# Altium project PendulOptic.PrjPcb
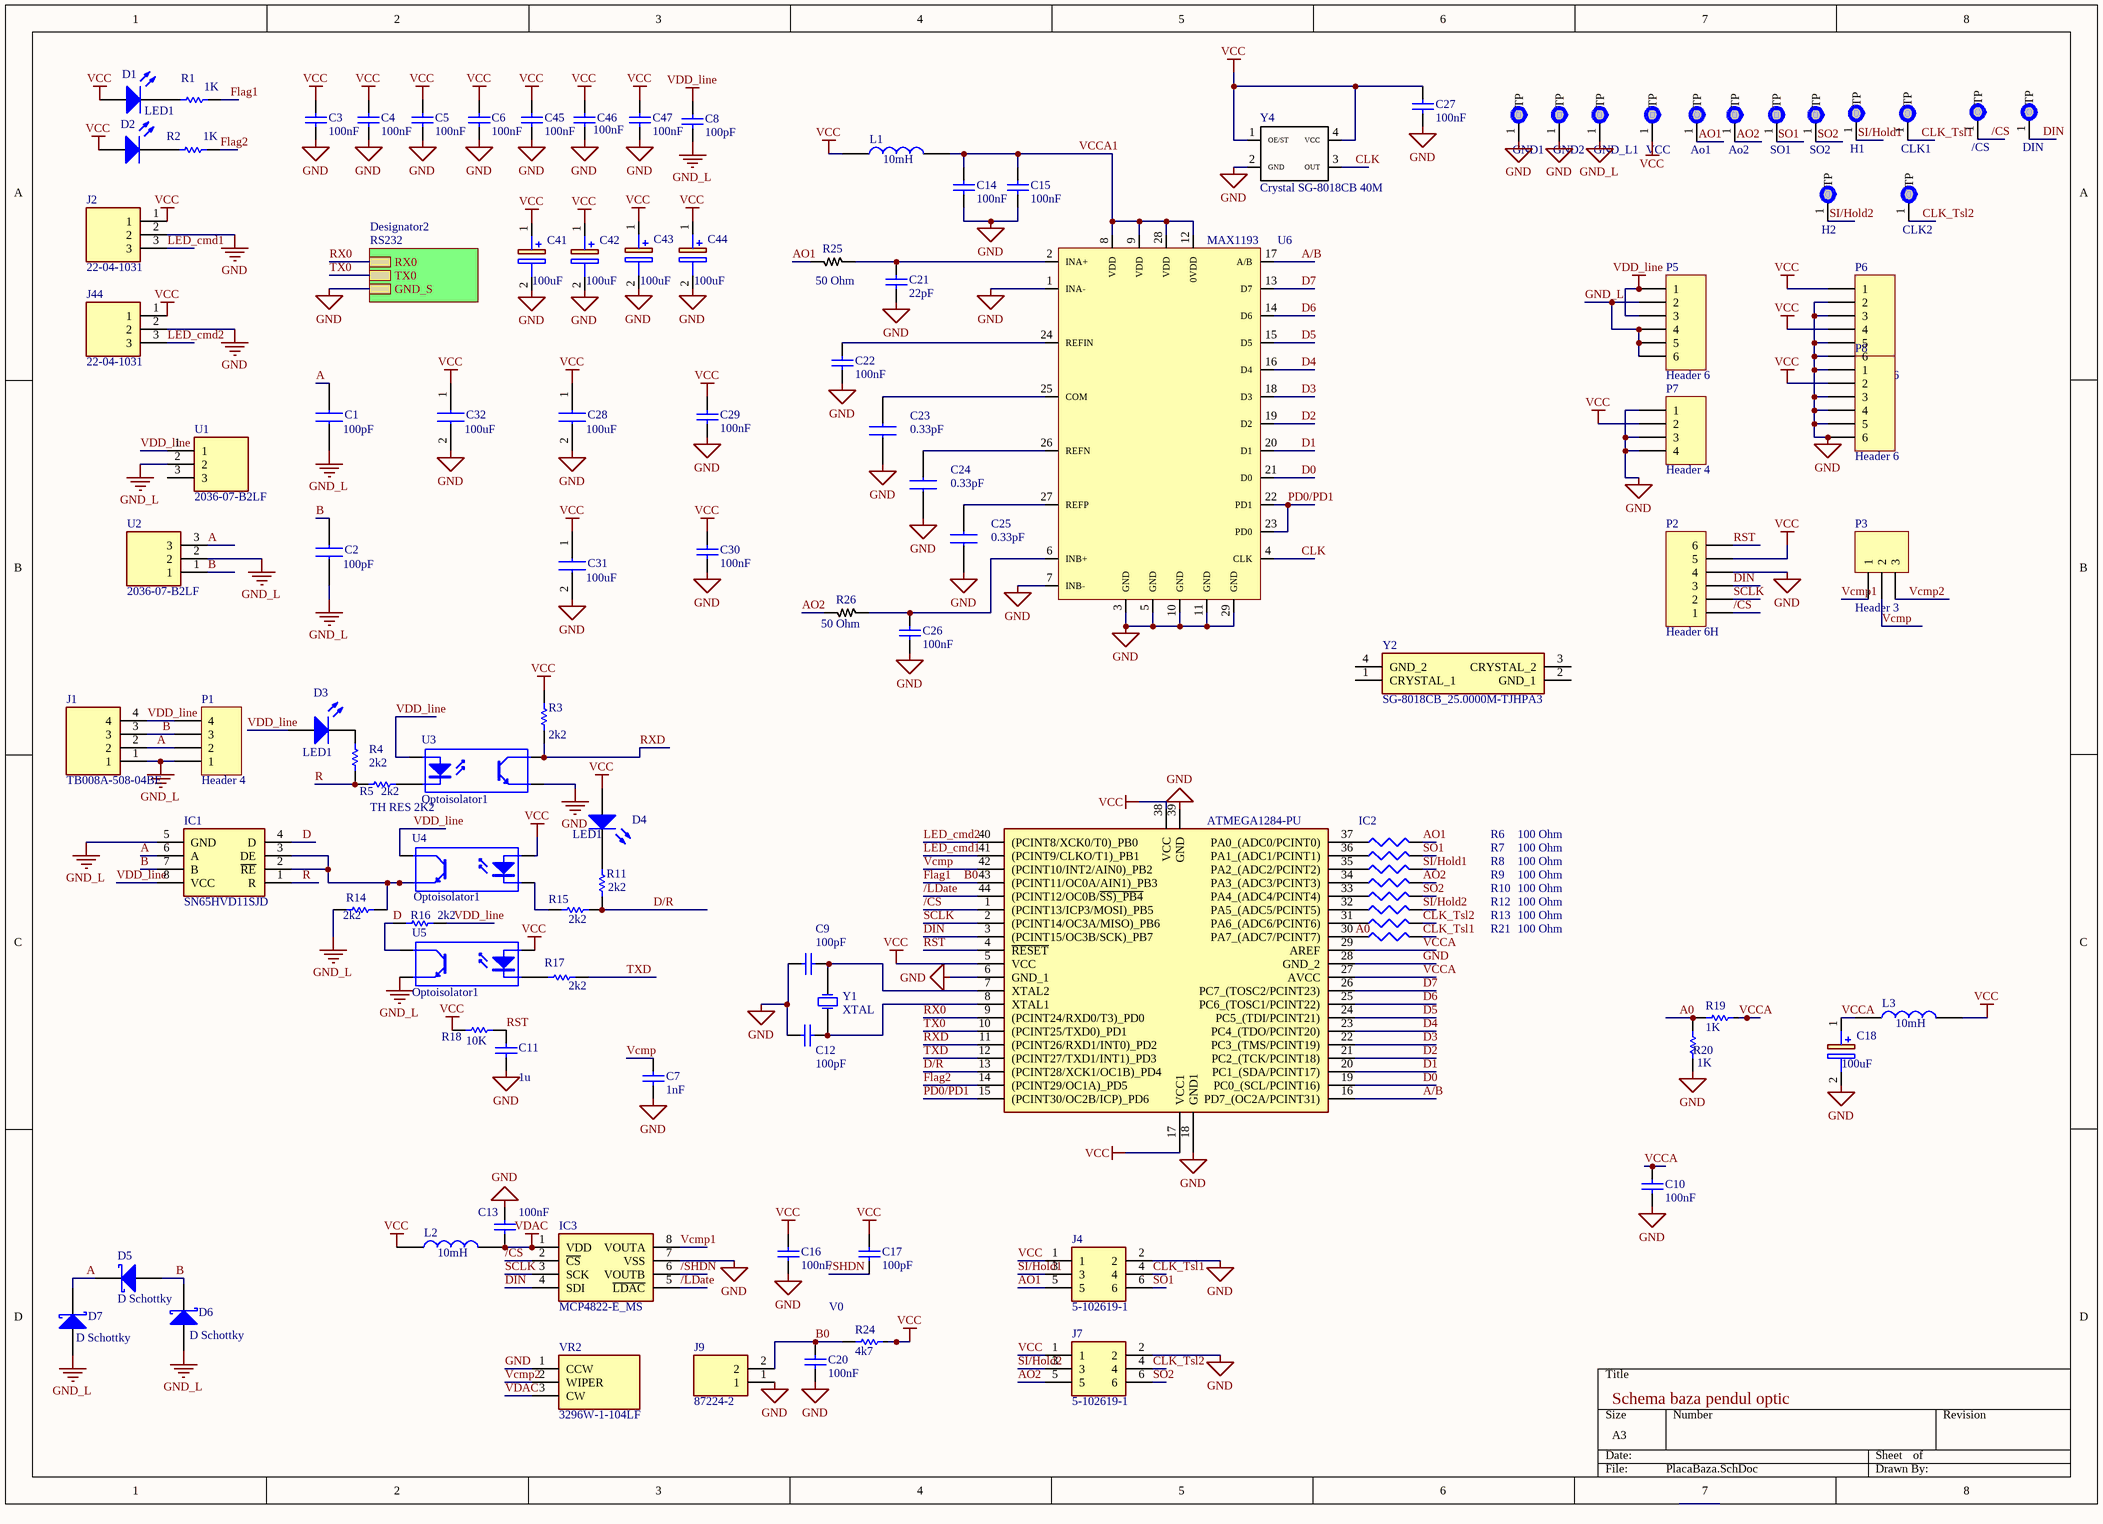
[diagram p0: PlacaBaza.SchDoc]
2 sheets, 133 parts. Net scope: hierarchical (ports join the sheet entries above them; power ports are global).
Board file: PendulOptic_pcb 1.PcbDoc
Sheets:
  PlacaBaza.SchDoc
    Designator2 = RS232.SchDoc

## Sheet PlacaBaza.SchDoc
size A3

### Parts
/CS  Testpoint  [TP]  (value not drawn)
Ao1  Testpoint  [TP]  (value not drawn)
Ao2  Testpoint  [TP]  (value not drawn)
C1  value 100pF  [1206 CAP]  (hidden comment: 1206CAP 100pF)
C2  value 100pF  [1206 CAP]  (hidden comment: 1206CAP 100pF)
C3  value 100nF  [1206 CAP]  (hidden comment: 1206CAP 100nF)
C4  value 100nF  [1206 CAP]  (hidden comment: 1206CAP 100nF)
C5  value 100nF  [1206 CAP]  (hidden comment: 1206CAP 100nF)
C6  value 100nF  [1206 CAP]  (hidden comment: 1206CAP 100nF)
C7  value 1nF  [1206 CAP]  (hidden comment: 1206CAP 1nF)
C8  value 100pF  [1206 CAP]  (hidden comment: 1206CAP 100nF)
C9  value 100pF  [1206 CAP]  (hidden comment: 1206CAP 100pF)
C10  value 100nF  [1206 CAP]  (hidden comment: 1206CAP 100nF)
C11  value 1u  [1206 CAP]  (hidden comment: 1206CAP 1uF)
C12  value 100pF  [1206 CAP]  (hidden comment: 1206CAP 100pF)
C13  value 100nF  [1206 CAP]  (hidden comment: 1206CAP 100nF)
C14  value 100nF  [1206 CAP]  (hidden comment: 1206CAP 100nF)
C15  value 100nF  [1206 CAP]  (hidden comment: 1206CAP 100nF)
C16  value 100nF  [1206 CAP]  (hidden comment: 1206CAP 100nF)
C17  value 100pF  [1206 CAP]  (hidden comment: 1206CAP 100pF)
C18  value 100uF  [CAPPRD275W50D630H1100]  (hidden comment: polarized cap 2.75 pitch)
C20  value 100nF  [1206 CAP]  (hidden comment: 1206CAP 100nF)
C21  value 22pF  [1206 CAP]  (hidden comment: 1206CAP 22pF)
C22  value 100nF  [1206 CAP]  (hidden comment: 1206CAP 100nF)
C23  value 0.33pF  [0805]  (hidden comment: 1206CAP 0.33uF)
C24  value 0.33pF  [0805]  (hidden comment: 1206CAP 0.33uF)
C25  value 0.33pF  [0805]  (hidden comment: 1206CAP 0.33uF)
C26  value 100nF  [1206 CAP]  (hidden comment: 1206CAP 100nF)
C27  value 100nF  [1206 CAP]  (hidden comment: 1206CAP 100nF)
C28  value 100uF  [CAPPRD275W50D630H1100]  (hidden comment: polarized cap 2.75mm pitch)
C29  value 100nF  [1206 CAP]  (hidden comment: 1206CAP 100nF)
C30  value 100nF  [1206 CAP]  (hidden comment: 1206CAP 100nF)
C31  value 100uF  [CAPPRD275W50D630H1100]  (hidden comment: polarized cap 2.75mm pitch)
C32  value 100uF  [CAPPRD275W50D630H1100]  (hidden comment: polarized cap 2.75mm pitch)
C41  value 100uF  [CAPPRD275W50D630H1100]  (hidden comment: polarized cap 2.75mm pitch)
C42  value 100uF  [CAPPRD275W50D630H1100]  (hidden comment: polarized cap 2.75mm pitch)
C43  value 100uF  [CAPPRD275W50D630H1100]  (hidden comment: polarized cap 2.75mm pitch)
C44  value 100uF  [CAPPRD275W50D630H1100]  (hidden comment: polarized cap 2.75mm pitch)
C45  value 100nF  [1206 CAP]  (hidden comment: 1206CAP 100nF)
C46  value 100nF  [1206 CAP]  (hidden comment: 1206CAP 100nF)
C47  value 100nF  [1206 CAP]  (hidden comment: 1206CAP 100nF)
CLK1  Testpoint  [TP]  (value not drawn)
CLK2  Testpoint  [TP]  (value not drawn)
D1  LED1  [LED-1]
D2  LED1  [LED-1]  (value not drawn)
D3  LED1  [C1206]
D4  LED1  [C1206]
D5  D Schottky  [SMB]
D6  D Schottky  [SMB]
D7  D Schottky  [SMB]
DIN  Testpoint  [TP]  (value not drawn)
GND1  Testpoint  [TP]  (value not drawn)
GND2  Testpoint  [TP]  (value not drawn)
GND_L1  Testpoint  [TP]  (value not drawn)
H1  Testpoint  [TP]  (value not drawn)
H2  Testpoint  [TP]  (value not drawn)
IC1  SN65HVD11SJD  [DIP-8]
IC2  ATMEGA1284-PU  [QFP80P1200X1200X120-44N]
IC3  MCP4822-E_MS  [SOP65P490X110-8N]
J1  TB008A-508-04BE  [HDR1X4]
J2  22-04-1031  [SHDR3W64P0X250_1X3_700X580X1170P]
J4  5-102619-1  [SHDR6W66P254_2X3_1473X1016X1118P]
J7  5-102619-1  [SHDR6W66P254_2X3_1473X1016X1118P]
J9  87224-2  [872242]
J44  22-04-1031  [SHDR3W64P0X250_1X3_700X580X1170P]
L1  value 10mH  [RLB0608471KL]  (hidden comment: RLB0608-471KL)
L2  value 10mH  [RLB0608471KL]  (hidden comment: RLB0608-471KL)
L3  value 10mH  [RLB0608471KL]  (hidden comment: RLB0608-471KL)
P1  Header 4  [HDR1X4]
P2  Header 6H  [HDR1X6]
P3  Header 3  [HDR1X3]
P5  Header 6  [HDR1X6]
P6  Header 6  [HDR1X6]
P7  Header 4  [HDR1X4]
P8  Header 6  [HDR1X6]
R1  value 1K  [AXIAL-0.3]  (hidden comment: TH RES 1K)
R2  value 1K  [AXIAL-0.3]  (hidden comment: TH RES 1K)
R3  value 2k2  [AXIAL-0.3]  (hidden comment: TH RES 2K2)
R4  value 2k2  [AXIAL-0.3]  (hidden comment: TH RES 2K2)
R5  TH RES 2K2  value 2k2  [AXIAL-0.3]
R6  value 100 Ohm  [0805]  (hidden comment: 0805RES 100 OHM)
R7  value 100 Ohm  [0805]  (hidden comment: 0805RES 100 OHM)
R8  value 100 Ohm  [0805]  (hidden comment: 0805RES 100 OHM)
R9  value 100 Ohm  [0805]  (hidden comment: 0805RES 100 OHM)
R10  value 100 Ohm  [0805]  (hidden comment: 0805RES 100 OHM)
R11  value 2k2  [AXIAL-0.3]  (hidden comment: TH RES 2K2)
R12  value 100 Ohm  [0805]  (hidden comment: 0805RES 100 OHM)
R13  value 100 Ohm  [0805]  (hidden comment: 0805RES 100 OHM)
R14  value 2k2  [AXIAL-0.3]  (hidden comment: TH RES 2K2)
R15  value 2k2  [AXIAL-0.3]  (hidden comment: TH RES 2K2)
R16  value 2k2  [AXIAL-0.3]  (hidden comment: TH RES 2K2)
R17  value 2k2  [AXIAL-0.3]  (hidden comment: TH RES 2K2)
R18  value 10K  [C1206]  (hidden comment: TH RES 2K2)
R19  value 1K  [1206 CAP]  (hidden comment: 1206RES 1K)
R20  value 1K  [1206 CAP]  (hidden comment: 1206RES 1K)
R21  value 100 Ohm  [0805]  (hidden comment: 0805RES 100 OHM)
R24  value 4k7  [1206 CAP]  (hidden comment: 1206RES 4K7)
R25  value 50 Ohm  [0805]  (hidden comment: 0805RES 50 OHM)
R26  value 50 Ohm  [0805]  (hidden comment: 0805RES 50 OHM)
SO1  Testpoint  [TP]  (value not drawn)
SO2  Testpoint  [TP]  (value not drawn)
U1  2036-07-B2LF  [203607B2LF]
U2  2036-07-B2LF  [203607B2LF]
U3  Optoisolator1  [DIP-4]
U4  Optoisolator1  [DIP-4]
U5  Optoisolator1  [DIP-4]
U6  MAX1193  [QFN50P500X500X80_HS-29N]
VCC  Testpoint  [TP]  (value not drawn)
VR2  3296W-1-104LF  [3296W-1]
Y1  XTAL  [RAD-0.2]
Y2  SG-8018CB_25.0000M-TJHPA3  [SG8018CB250000MTJHPA3]
Y4  Crystal SG-8018CB 40M  [SG-8018CB]

### Sub-sheets
Designator2 = RS232: RX0, TX0, GND_S

### Nets
GND: C3.1 C4.1 C5.1 C6.1 C7.1 C9.1 C10.1 C11.1 C12.1 C13.1 C14.1 C15.1 C16.1 C18.2(-) C20.1 C21.1 C22.1 C23.1 C24.1 C25.1 C26.1 C27.1 C28.2(-) C29.1 C30.1 C31.2(-) C32.2(-) C41.2(-) C42.2(-) C43.2(-) C44.2(-) C45.1 C46.1 C47.1 GND1.1(TP) GND2.1(TP) IC2.6(GND_1) IC2.18(GND1) IC2.28(GND_2) IC2.39(GND) IC3.7(VSS) J2.2 J4.2 J7.2 J9.1 J44.2 P2.4 P6.2 P6.3 P6.5 P6.6 P7.1 P7.3 P7.4 P8.1 P8.3 P8.4 P8.5 P8.6 R20.1 U3.3(E) U6.1(INA-) U6.3(GND) U6.5(GND) U6.7(INB-) U6.10(GND) U6.11(GND) U6.29(GND) VR2.1(CCW) Y4.2(GND) ; sheet Designator2/GND_S
GND_L: C1.1 C2.1 C8.1 D6.1(A) D7.1(A) GND_L1.1(TP) IC1.5(GND) J1.1 P1.1 P5.2 P5.4 P5.5 P5.6 R14.1 U1.2 U2.2 U5.3(E)
VCC: C3.2 C4.2 C5.2 C6.2 C16.2 C17.2 C27.2 C28.1(+) C29.2 C30.2 C31.1(+) C32.1(+) C41.1(+) C42.1(+) C43.1(+) C44.1(+) C45.2 C46.2 C47.2 D1.1(A) D2.1(A) D4.1(A) IC2.5(VCC) IC2.17(VCC1) IC2.38(VCC) J2.1 J4.1 J7.1 J44.1 L1.1 L2.1 L3.2 P2.5 P6.1 P6.4 P7.2 P8.2 R3.2 R18.1 R24.2 U4.1(A) U5.1(A) VCC.1(TP) Y4.1(OE/ST) Y4.4(VCC)
VDAC: C13.2 IC3.1(VDD) L2.2 VR2.3(CW)
VDD_line: C8.2 D3.1(A) IC1.8(VCC) J1.4 P1.4 P5.1 P5.3 R16.2 U1.1 U3.1(A) U4.4(C)
/CS: /CS.1(TP) IC2.1((PCINT13/ICP3/MOSI)_PB5) IC3.2(~{CS}) P2.1
/LDate: IC2.44((PCINT12/OC0B/~{SS)_PB4}) IC3.5(~{LDAC})
/SHDN: C17.1 IC3.6(VOUTB)
A: C1.2 D5.2(K) D7.2(K) IC1.6(A) J1.2 P1.2 U2.3
A0: IC2.30(PA7_(ADC7/PCINT7)) R19.1 R20.2 R21.1
A/B: IC2.16(PD7_(OC2A/PCINT31)) U6.17(A/B)
AO1: Ao1.1(TP) J4.5 R6.2 R25.2
AO2: Ao2.1(TP) J7.5 R9.2 R26.2
B: C2.2 D5.1(A) D6.2(K) IC1.7(B) J1.3 P1.3 U2.1
B0: C20.2 IC2.43((PCINT11/OC0A/AIN1)_PB3) J9.2 R1.1 R24.1  [also labelled Flag1]
CLK: U6.4(CLK) Y4.3(OUT)
CLK_Tsl1: CLK1.1(TP) J4.4 R21.2
CLK_Tsl2: CLK2.1(TP) J7.4 R13.2
D: IC1.4(D) R16.1 U5.4(C)
D0: IC2.19(PC0_(SCL/PCINT16)) U6.21(D0)
D1: IC2.20(PC1_(SDA/PCINT17)) U6.20(D1)
D2: IC2.21(PC2_(TCK/PCINT18)) U6.19(D2)
D3: IC2.22(PC3_(TMS/PCINT19)) U6.18(D3)
D4: IC2.23(PC4_(TDO/PCINT20)) U6.16(D4)
D5: IC2.24(PC5_(TDI/PCINT21)) U6.15(D5)
D6: IC2.25(PC6_(TOSC1/PCINT22)) U6.14(D6)
D7: IC2.26(PC7_(TOSC2/PCINT23)) U6.13(D7)
D/R: IC2.13((PCINT28/XCK1/OC1B)_PD4) R11.1 R15.2
DIN: DIN.1(TP) IC2.3((PCINT15/OC3B/SCK)_PB7) IC3.4(SDI) P2.3
Flag2: IC2.14((PCINT29/OC1A)_PD5) R2.1
LED_cmd1: IC2.41((PCINT9/CLKO/T1)_PB1) J2.3
LED_cmd2: IC2.40((PCINT8/XCK0/T0)_PB0) J44.3
PD0/PD1: IC2.15((PCINT30/OC2B/ICP)_PD6) U6.22(PD1) U6.23(PD0)
R: IC1.1(R) R4.1 R5.1
RST: C11.2 IC2.4(~{RESET}) P2.6 R18.2
RX0: IC2.9((PCINT24/RXD0/T3)_PD0) ; sheet Designator2/RX0
RXD: IC2.11((PCINT26/RXD1/INT0)_PD2) R3.1 U3.4(C)
SCLK: IC2.2((PCINT14/OC3A/MISO)_PB6) IC3.3(SCK) P2.2
SI/Hold1: H1.1(TP) J4.3 R8.2
SI/Hold2: H2.1(TP) J7.3 R12.2
SO1: J4.6 R7.2 SO1.1(TP)
SO2: J7.6 R10.2 SO2.1(TP)
TX0: IC2.10((PCINT25/TXD0)_PD1) ; sheet Designator2/TX0
TXD: IC2.12((PCINT27/TXD1/INT1)_PD3) R17.2
VCCA: C10.2 C18.1(+) IC2.27(AVCC) IC2.29(AREF) L3.1 R19.2
VCCA1: C14.2 C15.2 L1.2 U6.8(VDD) U6.9(VDD) U6.12(0VDD) U6.28(VDD)
Vcmp: C7.2 IC2.42((PCINT10/INT2/AIN0)_PB2) P3.2
Vcmp1: IC3.8(VOUTA) P3.1
Vcmp2: P3.3 VR2.2(WIPER)
NetC9_2: C9.2 IC2.7(XTAL2) Y1.2(OSC2)
NetC12_2: C12.2 IC2.8(XTAL1) Y1.1(OSC1)
NetC21_2: C21.2 R25.1 U6.2(INA+)
NetC22_2: C22.2 U6.24(REFIN)
NetC23_2: C23.2 U6.25(COM)
NetC24_2: C24.2 U6.26(REFN)
NetC25_2: C25.2 U6.27(REFP)
NetC26_2: C26.2 R26.1 U6.6(INB+)
NetD1_2: D1.2(K) R1.2
NetD2_2: D2.2(K) R2.2
NetD3_2: D3.2(K) R4.2
NetD4_2: D4.2(K) R11.2
NetIC1_2: IC1.2(~{RE}) IC1.3(DE) R14.2 U4.3(E)
NetIC2_31: IC2.31(PA6_(ADC6/PCINT6)) R13.1
NetIC2_32: IC2.32(PA5_(ADC5/PCINT5)) R12.1
NetIC2_33: IC2.33(PA4_(ADC4/PCINT4)) R10.1
NetIC2_34: IC2.34(PA3_(ADC3/PCINT3)) R9.1
NetIC2_35: IC2.35(PA2_(ADC2/PCINT2)) R8.1
NetIC2_36: IC2.36(PA1_(ADC1/PCINT1)) R7.1
NetIC2_37: IC2.37(PA0_(ADC0/PCINT0)) R6.1
NetR5_2: R5.2 U3.2(K)
NetR15_1: R15.1 U4.2(K)
NetR17_1: R17.1 U5.2(K)

Not connected (* = marked no-connect by the designer): U1 3; Y2 1(CRYSTAL_1) 2(GND_1) 3(CRYSTAL_2) 4(GND_2)

### Notes on the sheet
- V0
- Schema baza pendul optic

### Library data of the parts
/CS Ao1 Ao2 CLK1 CLK2 DIN GND1 GND2 GND_L1 H1 H2 SO1 SO2 VCC = Test point
C1 C2 = 04023A101FAT2A: Manufacturer_Name: AVX; Datasheet Link: http://www.mouser.com/catalog/supplier/library/pdf/AVXSurfaceMountCeramic.pdf; Height: 0.56mm; Manufacturer_Part_Number: 04023A101FAT2A; Mouser Part Number: 581-04023A101F; Mouser Price/Stock: https://www.mouser.co.uk/ProductDetail/AVX/04023A101FAT2A/?qs=TT2fvNIaLUf5Vh3Ocjdicw%3D%3D; Arrow Part Number: 04023A101FAT2A; Arrow Price/Stock: https://www.arrow.com/en/products/04023a101fat2a/avx
C3-C8 C10 C11 C13-C17 C20-C22 C26 C27 C29 C30 C45-C47 = Cap: Published: 8-Jun-2000; LatestRevisionDate: 17-Jul-2002; LatestRevisionNote: Re-released for DXP Platform.; PackageReference: RAD-0.3; Publisher: Altium Limited; PackageDescription: Radial Cap, Thru-Hole; 2 Leads; 0.3 in Pin Spacing
C9 C12 = Cap Semi: Published: 8-Jun-2000; LatestRevisionDate: 29-May-2009; LatestRevisionNote: IPC-7351 Footprint Added.; PackageReference: C1206; Publisher: Altium Limited; PackageDescription: Chip Capacitor
C18 C41-C44 = MAL215299601E3: Manufacturer_Name: Vishay; Datasheet Link: https://www.vishay.com/docs/28459/152cme.pdf; Height: 10.5mm; Manufacturer_Part_Number: MAL215299601E3; Mouser Part Number: 594-MAL215299601E3; Mouser Price/Stock: https://www.mouser.co.uk/ProductDetail/Vishay-BC-Components/MAL215299601E3?qs=xZ%2FP%252Ba9zWqbQPLOp9z%2FTFg%3D%3D
C23-C25 = 08055A150JAT2A: Manufacturer_Name: Kyocera AVX; Datasheet Link: https://componentsearchengine.com/Datasheets/1/06031A100FAT2A.pdf; Height: 0.94mm; Manufacturer_Part_Number: 08055A150JAT2A; Mouser Part Number: 581-08055A150J; Mouser Price/Stock: https://www.mouser.co.uk/ProductDetail/AVX/08055A150JAT2A?qs=pZVDklL%2Fs8hiEua37sqbaA%3D%3D; Arrow Part Number: 08055A150JAT2A; Arrow Price/Stock: https://www.arrow.com/en/products/08055a150jat2a/avx?region=nac
C28 C31 C32 = MAL203855101E3: Manufacturer_Name: Vishay; Datasheet Link: https://ms.componentsearchengine.com/Datasheets/2/MAL203855101E3.pdf; Height: 11mm; Manufacturer_Part_Number: MAL203855101E3; Mouser Part Number: 594-MAL203855101E3; Mouser Price/Stock: https://www.mouser.co.uk/ProductDetail/Vishay-BC-Components/MAL203855101E3?qs=G99oyVYclWVud%252B%2Fs3vRKoA%3D%3D
D1-D4 = LED1: Typical RED GaAs LED; Published: 8-Jun-2000; LatestRevisionDate: 08-Jul-2005; LatestRevisionNote: Mech Layer 1 removed.; PackageReference: LED-1; Publisher: Altium Limited; PackageDescription: LED; 2 Leads
D5-D7 = D Schottky: Schottky Diode; Published: 8-Jun-2000; LatestRevisionDate: 17-Jul-2002; LatestRevisionNote: Re-released for DXP Platform.; PackageReference: SMB; Publisher: Altium Limited; PackageDescription: DO-214-AA/SMB; 2 C-Bend Leads; Body 5.3 x 3.6 mm, inc. leads (LxW); Code_JEDEC: DO-214-AA
IC1 = SN65HVD11SJD: Integrated Circuit; Manufacturer_Name: Texas Instruments; Datasheet Link: https://www.arrow.com/en/products/sn65hvd11sjd/texas-instruments; Height: 4.45mm; Manufacturer_Part_Number: SN65HVD11SJD; Mouser Part Number: 595-SN65HVD11SJD; Arrow Part Number: SN65HVD11SJD; Arrow Price/Stock: https://www.arrow.com/en/products/sn65hvd11sjd/texas-instruments
IC2 = ATMEGA1284-PU: Integrated Circuit; Manufacturer_Name: Microchip; Datasheet Link: https://datasheet.datasheetarchive.com/originals/distributors/Datasheets_SAMA/b69cbc8d70054e051fa5fe38e41d8927.pdf; Height: 4.826mm; Manufacturer_Part_Number: ATMEGA1284-PU; Mouser Part Number: 556-ATMEGA1284-PU; Mouser Price/Stock: https://www.mouser.co.uk/ProductDetail/Microchip-Technology-Atmel/ATMEGA1284-PU?qs=lwdSMh1%2FoYI%2FXs3D3l%2Fp1w%3D%3D; Arrow Part Number: ATMEGA1284-PU; Arrow Price/Stock: https://www.arrow.com/en/products/atmega1284-pu/microchip-technology?region=nac
IC3 = MCP4822-E_MS: Integrated Circuit; Manufacturer_Name: Microchip; Manufacturer_Part_Number: MCP4822-E/MS; Datasheet Link: https://datasheet.datasheetarchive.com/originals/distributors/Datasheets-DGA17/911642.pdf; Height: 1.1mm; Mouser Part Number: 579-MCP4822-E/MS; Mouser Price/Stock: https://www.mouser.co.uk/ProductDetail/Microchip-Technology-Atmel/MCP4822-E-MS?qs=usxtMOJb1Rzc5xsp0Zr6iQ%3D%3D; Arrow Part Number: MCP4822-E/MS; Arrow Price/Stock: https://www.arrow.com/en/products/mcp4822-ems/microchip-technology?region=nac
J1 = TB008A-508-04BE: Connector; Manufacturer_Name: CUI Devices; Datasheet Link: https://www.mouser.com/datasheet/2/670/tb008a_508-1550650.pdf; Height: 16.22mm; Manufacturer_Part_Number: TB008A-508-04BE; Mouser Part Number: 490-TB008A-508-04BE; Mouser Price/Stock: https://www.mouser.co.uk/ProductDetail/CUI-Devices/TB008A-508-04BE?qs=vLWxofP3U2wE%252BeCFz1tLxg%3D%3D
J2 J44 = 22-04-1031: Connector; Manufacturer_Name: Molex; Datasheet Link: https://componentsearchengine.com/Datasheets/2/22-04-1031.pdf; Height: 11.7mm; Manufacturer_Part_Number: 22-04-1031; Mouser Part Number: 538-22-04-1031; Mouser Price/Stock: https://www.mouser.co.uk/ProductDetail/Molex/22-04-1031?qs=h9d0Ik7kMyy7or8gS%2F3ZEA%3D%3D
J4 J7 = 5-102619-1: Connector; Manufacturer_Name: TE Connectivity; Datasheet Link: https://www.te.com/commerce/DocumentDelivery/DDEController?Action=showdoc&DocId=Customer+Drawing%7F102619%7FK3%7Fpdf%7FEnglish%7FENG_CD_102619_K3.pdf%7F5-102619-1; Height: 11.176mm; Manufacturer_Part_Number: 5-102619-1; Mouser Part Number: 571-5-102619-1; Mouser Price/Stock: https://www.mouser.com/Search/Refine.aspx?Keyword=571-5-102619-1; Arrow Part Number: 5-102619-1; Arrow Price/Stock: https://www.arrow.com/en/products/5-102619-1/te-connectivity
J9 = 87224-2: Connector; Manufacturer_Name: TE Connectivity; Datasheet Link: https://datasheet.datasheetarchive.com/originals/distributors/Datasheets_SAMA/3b9b08c08f06dc562fe3ba32b60fa864.pdf; Height: 10.3632mm; Manufacturer_Part_Number: 87224-2; Mouser Part Number: 571-872242; Mouser Price/Stock: https://www.mouser.co.uk/ProductDetail/TE-Connectivity/87224-2?qs=ZDXmSm13591yVHBRfmL3UQ%3D%3D; Arrow Part Number: 87224-2; Arrow Price/Stock: https://www.arrow.com/en/products/87224-2/te-connectivity?region=europe
L1-L3 = RLB0608-471KL: Inductor; Manufacturer_Name: Bourns; Datasheet Link: https://componentsearchengine.com/Datasheets/2/RLB0608-471KL.pdf; Height: 7.5mm; Manufacturer_Part_Number: RLB0608-471KL; Mouser Part Number: 652-RLB0608-471KL; Mouser Price/Stock: https://www.mouser.co.uk/ProductDetail/Bourns/RLB0608-471KL?qs=qtLBrsE9qZLH%252BdKTQ9WHfg%3D%3D; Arrow Part Number: RLB0608-471KL; Arrow Price/Stock: https://www.arrow.com/en/products/rlb0608-471kl/bourns
P1 P7 = Header 4: Header, 4-Pin; LatestRevisionDate: 17-Jul-2002; LatestRevisionNote: Re-released for DXP Platform.; Publisher: Altium Limited
P2 = Header 6H: Header, 6-Pin, Right Angle; LatestRevisionDate: 17-Jul-2002; LatestRevisionNote: Re-released for DXP Platform.; Publisher: Altium Limited
P3 = Header 3: Header, 3-Pin; LatestRevisionDate: 17-Jul-2002; LatestRevisionNote: Re-released for DXP Platform.; Publisher: Altium Limited
P5 P6 P8 = Header 6: Header, 6-Pin; LatestRevisionDate: 17-Jul-2002; LatestRevisionNote: Re-released for DXP Platform.; Publisher: Altium Limited
R1-R5 R11 R14-R20 R24 = Res1: Published: 8-Jun-2000; LatestRevisionDate: 17-Jul-2002; LatestRevisionNote: Re-released for DXP Platform.; PackageReference: AXIAL-0.3; Publisher: Altium Limited; PackageDescription: Axial Device, Thru-Hole; 2 Leads; 0.3 in Pin Spacing
R6-R10 R12 R13 R21 = Res3: Published: 8-Jun-2000; LatestRevisionDate: 29-May-2009; LatestRevisionNote: IPC-7351 Footprint Added.; PackageReference: J1-0603; Publisher: Altium Limited; PackageDescription: Chip Resistor
R25 R26 = RES 0402
U1 U2 = 2036-07-B2LF: Undefined or Miscellaneous; Manufacturer_Name: Bourns; Datasheet Link: https://www.bourns.com/docs/Product-Datasheets/2036.pdf; Height: 5.3mm; Manufacturer_Part_Number: 2036-07-B2LF; Mouser Part Number: 652-2036-07-B2LF; Mouser Price/Stock: https://www.mouser.co.uk/ProductDetail/Bourns/2036-07-B2LF?qs=kJlCKCzaZTNDPuw9%252B%252B%252BnbA%3D%3D; Arrow Part Number: 2036-07-B2LF; Arrow Price/Stock: https://www.arrow.com/en/products/2036-07-b2lf/bourns?region=nac
U3-U5 = Optoisolator1: 4-Pin Phototransistor Optocoupler; Published: 24-Mar-1999; LatestRevisionDate: 04-Mar-2005; LatestRevisionNote: Sch pins 3 & 4 Swapped.; DatasheetVersion: Nov-2003; PackageReference: DIP-4; Publisher: Altium Limited
VR2 = 3296W-1-104LF: Variable Resistor; Manufacturer_Name: Bourns; Datasheet Link: https://datasheet.datasheetarchive.com/originals/distributors/Datasheets-10/DSA-187647.pdf; Manufacturer_Part_Number: 3296W-1-104LF; Mouser Part Number: 652-3296W-1-104LF; Mouser Price/Stock: https://www.mouser.co.uk/ProductDetail/Bourns/3296W-1-104LF?qs=NxuKWO2Bm4Yv9t2iisRb6w%3D%3D; Arrow Part Number: 3296W-1-104LF; Arrow Price/Stock: https://www.arrow.com/en/products/3296w-1-104lf/bourns?region=europe
Y1 = XTAL: Crystal Oscillator; Published: 8-Jun-2000; LatestRevisionDate: 17-Jul-2002; LatestRevisionNote: Re-released for DXP Platform.; PackageReference: R38; Publisher: Altium Limited; PackageDescription: Crystal, Thru-Hole; 2 Leads; Body 3.1 x 8.2 mm (Dia.xH)
Y2 = SG-8018CB_25.0000M-TJHPA3: Crystal or Oscillator; Manufacturer_Name: Epson Timing; Manufacturer_Part_Number: SG-8018CB 25.0000M-TJHPA3; Datasheet Link: https://www.mouser.co.uk/datasheet/2/137/SG_8018CA_en-1649548.pdf; Height: 1.1mm; Mouser Part Number: 732-CB25M-TJHPA3; Mouser Price/Stock: https://www.mouser.co.uk/ProductDetail/Epson-Timing/SG-8018CB-250000M-TJHPA3/?qs=%252B6g0mu59x7J5XHtIJpFBdA%3D%3D

## Sheet RS232.SchDoc
size A4
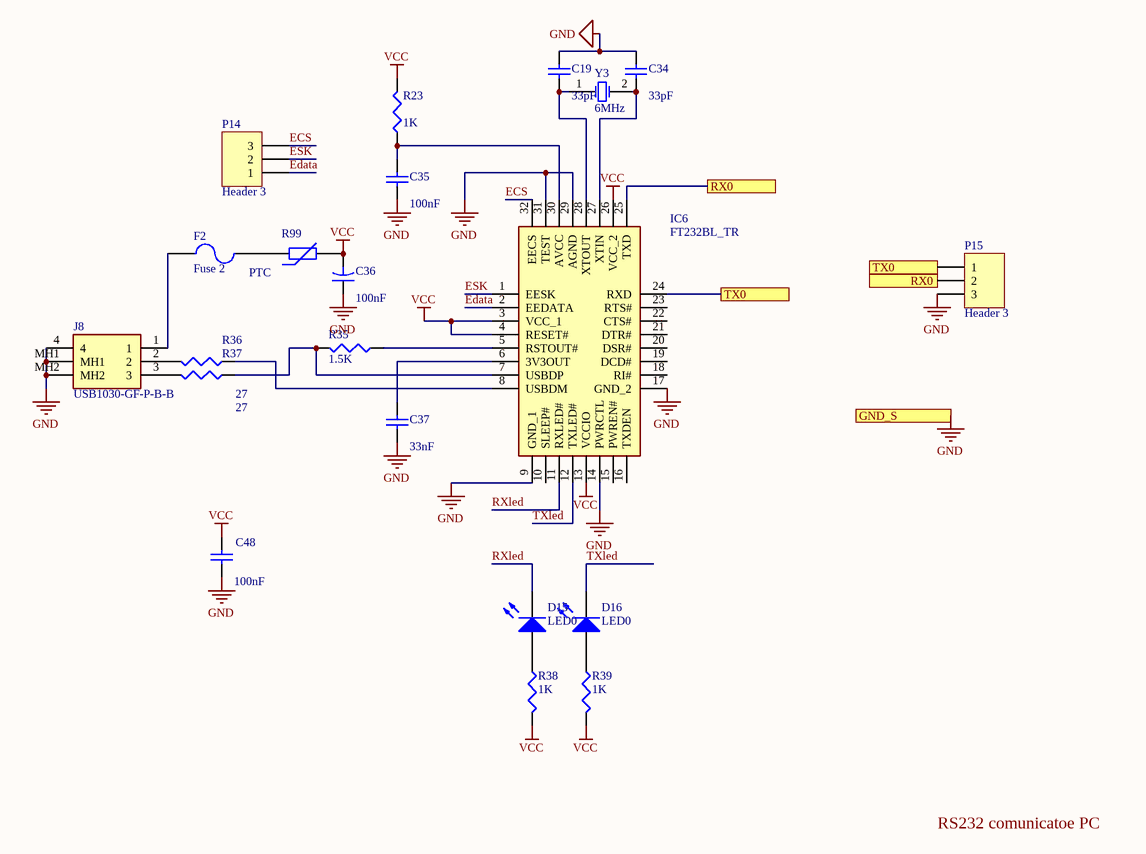
[diagram p1: RS232.SchDoc]

### Parts
C19  value 33pF  [1206 CAP]  (hidden comment: 1206CAP 33pF)
C34  value 33pF  [1206 CAP]  (hidden comment: 1206CAP 33pF)
C35  value 100nF  [1206 CAP]  (hidden comment: 1206CAP 100nF)
C36  value 100nF  [TH polarized 5mm]  (hidden comment: polarized cap 5mm pitch)
C37  value 33nF  [1206 CAP]  (hidden comment: 1206CAP 33nF)
C48  value 100nF  [1206 CAP]  (hidden comment: 1206CAP 100nF)
D15  LED0  [6-0805_L]
D16  LED0  [6-0805_L]
F2  Fuse 2  [THROUGH HOLE 5mm]
IC6  FT232BL_TR  [QFP80P900X900X160-32N]
J8  USB1030-GF-P-B-B  [USB1030GFPBB]
P14  Header 3  [HDR1X3]
P15  Header 3  [HDR1X3]
R23  value 1K  [0805]  (hidden comment: 0805RES 1K)
R35  value 1.5K  [1206 CAP]  (hidden comment: 1206RES 1K5)
R36  value 27  [1206 CAP]  (hidden comment: 1206RES 27 OHM)
R37  value 27  [1206 CAP]  (hidden comment: 1206RES 27 OHM)
R38  value 1K  [J1-0603]  (hidden comment: 0603RES 1K)
R39  value 1K  [J1-0603]  (hidden comment: 0603RES 1K)
R99  PTC  [R38]
Y3  6MHz  [RAD-0.2]

### Ports
GND_S, RX0, TX0

### Nets
GND: C19.1 C34.1 C35.1 C36.1 C37.1 C48.1 IC6.9(GND_1) IC6.14(PWRCTL) IC6.17(GND_2) IC6.29(AGND) IC6.31(TEST) J8.4 J8.MH1 J8.MH2 P15.3 ; port GND_S
VCC: C36.2 C48.2 IC6.3(VCC_1) IC6.4(RESET#) IC6.13(VCCIO) IC6.26(VCC_2) R23.2 R38.2 R39.2 R99.2
ECS: IC6.32(EECS) P14.3
Edata: IC6.2(EEDATA) P14.1
ESK: IC6.1(EESK) P14.2
RX0: IC6.25(TXD) P15.2 ; port RX0
RXled: D15.2(K) IC6.11(RXLED#)
TX0: IC6.24(RXD) P15.1 ; port TX0
TXled: D16.2(K) IC6.12(TXLED#)
NetC19_2: C19.2 IC6.28(XTOUT) Y3.1(OSC1)
NetC34_2: C34.2 IC6.27(XTIN) Y3.2(OSC2)
NetC35_2: C35.2 IC6.30(AVCC) R23.1
NetC37_2: C37.2 IC6.6(3V3OUT)
NetD15_1: D15.1(A) R38.1
NetD16_1: D16.1(A) R39.1
NetF2_1: F2.1 J8.1
NetF2_2: F2.2 R99.1
NetIC6_5: IC6.5(RSTOUT#) R35.1
NetIC6_7: IC6.7(USBDP) R35.2 R37.1
NetIC6_8: IC6.8(USBDM) R36.1
NetJ8_2: J8.2 R36.2
NetJ8_3: J8.3 R37.2

Not connected (* = marked no-connect by the designer): IC6 10(SLEEP#) 15(PWREN#) 16(TXDEN) 18(RI#) 19(DCD#) 20(DSR#) 21(DTR#) 22(CTS#) 23(RTS#)

### Notes on the sheet
- RS232 comunicatoe PC

### Library data of the parts
C19 C34 C35 C37 C48 = Cap Semi: Published: 8-Jun-2000; LatestRevisionDate: 29-May-2009; LatestRevisionNote: IPC-7351 Footprint Added.; PackageReference: C1206; Publisher: Altium Limited; PackageDescription: Chip Capacitor
C36 = Cap2: Published: 23-Sep-2002; PackageReference: CAPR5-4X5; Publisher: Altium Limited; PackageDescription: Capacitor; 2 Leads
D15 D16 = LED0: Typical INFRARED GaAs LED; Published: 8-Jun-2000; LatestRevisionDate: 08-Jul-2005; LatestRevisionNote: Mech Layer 1 removed.; PackageReference: LED-0; Publisher: Altium Limited; PackageDescription: LED; 2 Leads
F2 = Fuse 2: Fuse; Published: 8-Jun-2000; LatestRevisionDate: 17-Jul-2002; LatestRevisionNote: Re-released for DXP Platform.; PackageReference: PIN-W2/E2.8; Publisher: Altium Limited; PackageDescription: Thru-Hole; 2 Leads
IC6 = FT232BL_TR: Integrated Circuit; Manufacturer_Name: FTDI Chip; Manufacturer_Part_Number: FT232BL/TR; Datasheet Link: http://www.ftdichip.com/Support/Documents/DataSheets/ICs/DS_FT232BL_BQ.pdf; Height: 1.6mm
J8 = USB1030-GF-P-B-B: Connector; Manufacturer_Name: GCT (GLOBAL CONNECTOR TECHNOLOGY); Datasheet Link: https://gct.co/files/drawings/usb1030.pdf?v=6f3e53a4-19ab-41a0-8ac3-960e4d6fce65; Height: 11.2mm; Manufacturer_Part_Number: USB1030-GF-P-B-B; Mouser Part Number: 640-USB1030-GF-P-B-B; Mouser Price/Stock: https://www.mouser.co.uk/ProductDetail/GCT/USB1030-GF-P-B-B?qs=KUoIvG%2F9Ila4yhPpaOZhHA%3D%3D
P14 P15 = Header 3: Header, 3-Pin; LatestRevisionDate: 17-Jul-2002; LatestRevisionNote: Re-released for DXP Platform.; Publisher: Altium Limited
R23 R35-R39 = Res3: Published: 8-Jun-2000; LatestRevisionDate: 29-May-2009; LatestRevisionNote: IPC-7351 Footprint Added.; PackageReference: J1-0603; Publisher: Altium Limited; PackageDescription: Chip Resistor
R99 = Res Varistor: Varistor (Voltage-Sensitive Resistor); Published: 24-Mar-1999; LatestRevisionDate: 29-May-2009; LatestRevisionNote: IPC-7351 Footprint Added.; PackageVersion: Mar-2003; PackageReference: 6-0805; Publisher: Altium Limited; PackageDescription: Chip Resistor 0805 Case Size; Code_IPC: RESC2012
Y3 = XTAL: Crystal Oscillator; Published: 8-Jun-2000; LatestRevisionDate: 17-Jul-2002; LatestRevisionNote: Re-released for DXP Platform.; PackageReference: R38; Publisher: Altium Limited; PackageDescription: Crystal, Thru-Hole; 2 Leads; Body 3.1 x 8.2 mm (Dia.xH)

## Nets that join several sheets
GND: PlacaBaza (70 pins), RS232 (15 pins)
VCC: PlacaBaza (45 pins), RS232 (10 pins)
RX0: PlacaBaza (IC2.9), RS232 (IC6.25 P15.2)
TX0: PlacaBaza (IC2.10), RS232 (IC6.24 P15.1)